# Altium project HYDRA_V2.1_NAV.PrjPcb
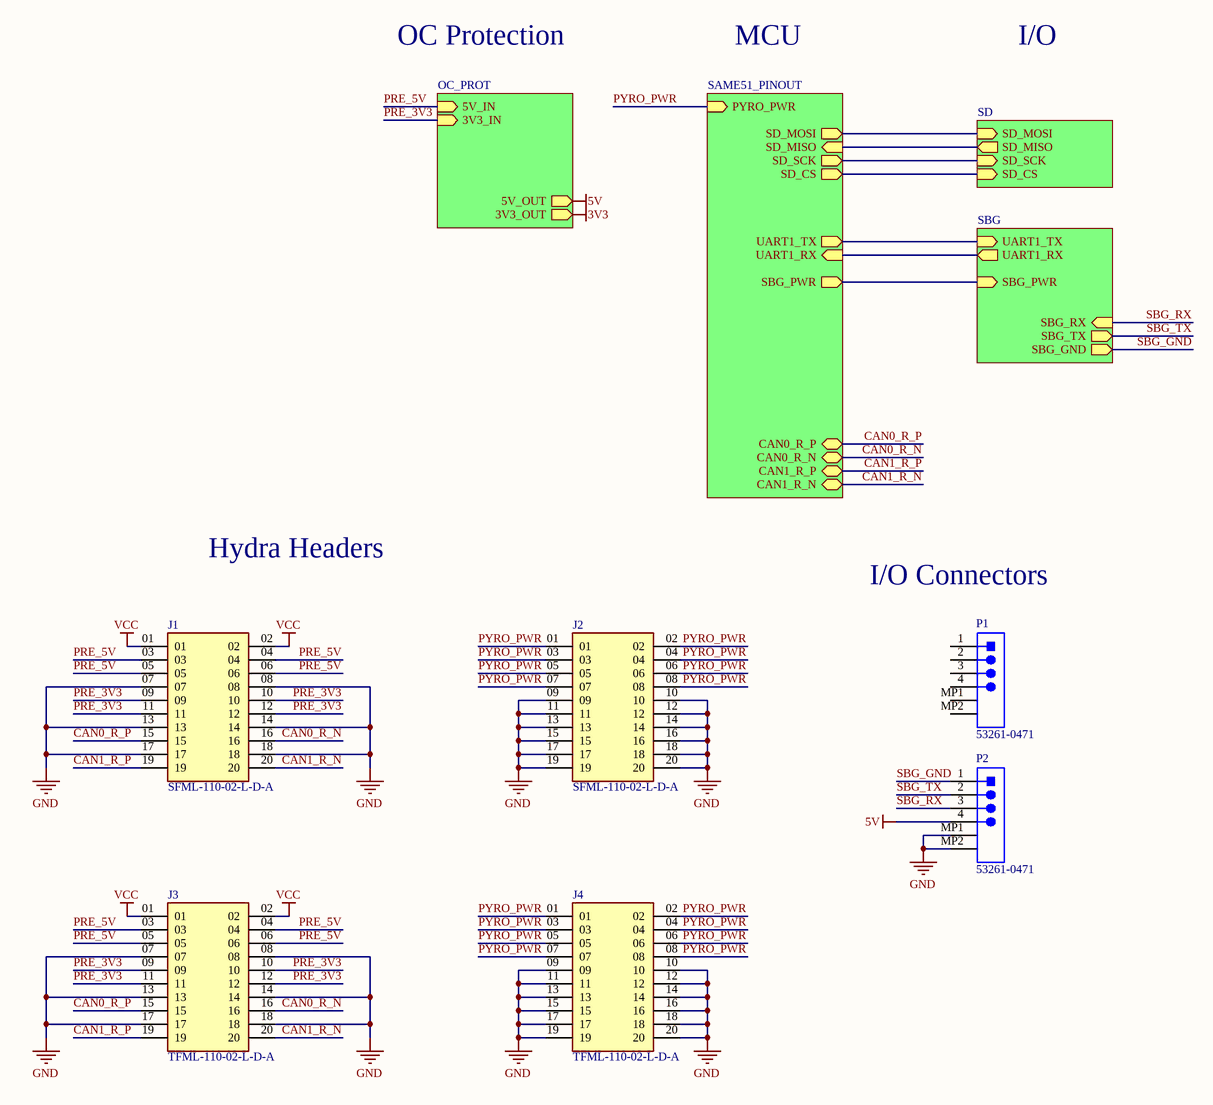
[diagram p0: HYDRA_V2.1_NAV.SchDoc]
4 sheets, 96 parts. Net scope: hierarchical (ports join the sheet entries above them; power ports are global).
Board files: HYDRA_V2.1_NAV.PcbDoc, HYDRA_V2.2_NAV.PcbDoc
Sheets:
  HYDRA_V2.1_NAV.SchDoc
    MCU_PINOUT = SAME51_PINOUT.SchDoc
    SBG = SBG.SchDoc
    SD = SD.SchDoc

## Sheet HYDRA_V2.1_NAV.SchDoc
size B; SheetNumber: 1; SheetTotal: 5

### Parts
J1  SFML-110-02-L-D-A  [SFML-110-02-L-D-A-Footprint-1]
J2  SFML-110-02-L-D-A  [SFML-110-02-L-D-A-Footprint-1]
J3  TFML-110-02-L-D-A  [TFML-110-02-L-D-A-Footprint-1]
J4  TFML-110-02-L-D-A  [TFML-110-02-L-D-A-Footprint-1]
P1  53261-0471  [MOLEX-53261-0471_V]
P2  53261-0471  [MOLEX-53261-0471_V]

### Sub-sheets
MCU_PINOUT = SAME51_PINOUT: CAN0_R_P (bidir), CAN0_R_N (bidir), PYRO_PWR (in), CAN1_R_P (bidir), CAN1_R_N (bidir), SD_MOSI (out), SD_MISO (in), SD_SCK (out), SD_CS (out), SBG_PWR (out), UART1_TX (out), UART1_RX (in)
OC_PROT = OC_PROT (file not in this document): 5V_OUT (out), 5V_IN (in), 3V3_IN (in), 3V3_OUT (out)
SBG = SBG: SBG_PWR (in), SBG_RX (in), SBG_TX (out), SBG_GND (out), UART1_TX (in), UART1_RX (out)
SD = SD: SD_MOSI (in), SD_MISO (out), SD_SCK (in), SD_CS (in)

### Nets
5V: P2.4 ; sheet OC_PROT/5V_OUT
GND: J1.07 J1.08 J1.13 J1.14 J1.17 J1.18 J2.09 J2.10 J2.11 J2.12 J2.13 J2.14 J2.15 J2.16 J2.17 J2.18 J2.19 J2.20 J3.07 J3.08 J3.13 J3.14 J3.17 J3.18 J4.09 J4.10 J4.11 J4.12 J4.13 J4.14 J4.15 J4.16 J4.17 J4.18 J4.19 J4.20 P2.MP1 P2.MP2
VCC: J1.01 J1.02 J3.01 J3.02
CAN0_R_N: J1.16 J3.16 ; sheet MCU_PINOUT/CAN0_R_N
CAN0_R_P: J1.15 J3.15 ; sheet MCU_PINOUT/CAN0_R_P
CAN1_R_N: J1.20 J3.20 ; sheet MCU_PINOUT/CAN1_R_N
CAN1_R_P: J1.19 J3.19 ; sheet MCU_PINOUT/CAN1_R_P
PRE_3V3: J1.09 J1.10 J1.11 J1.12 J3.09 J3.10 J3.11 J3.12 ; sheet OC_PROT/3V3_IN
PRE_5V: J1.03 J1.04 J1.05 J1.06 J3.03 J3.04 J3.05 J3.06 ; sheet OC_PROT/5V_IN
PYRO_PWR: J2.01 J2.02 J2.03 J2.04 J2.05 J2.06 J2.07 J2.08 J4.01 J4.02 J4.03 J4.04 J4.05 J4.06 J4.07 J4.08 ; sheet MCU_PINOUT/PYRO_PWR
SBG_GND: P2.1 ; sheet SBG/SBG_GND
SBG_PWR: sheet MCU_PINOUT/SBG_PWR, sheet SBG/SBG_PWR
SBG_RX: P2.3 ; sheet SBG/SBG_RX  [project net SBG_RS232_RX]
SBG_TX: P2.2 ; sheet SBG/SBG_TX  [project net SBG_RS232_TX]
SD_CLK: sheet MCU_PINOUT/SD_SCK, sheet SD/SD_SCK
SD_CMD: sheet MCU_PINOUT/SD_MOSI, sheet SD/SD_MOSI
SD_CS: sheet MCU_PINOUT/SD_CS, sheet SD/SD_CS
SD_DAT0: sheet MCU_PINOUT/SD_MISO, sheet SD/SD_MISO
UART1_RX: sheet MCU_PINOUT/UART1_RX, sheet SBG/UART1_RX
UART1_TX: sheet MCU_PINOUT/UART1_TX, sheet SBG/UART1_TX

Not connected (* = marked no-connect by the designer): P1 1 2 3 4 MP1 MP2

### Notes on the sheet
- OC Protection
- MCU
- I/O
- Hydra Headers
- I/O Connectors

### Library data of the parts
J1 J2 = CMP-002-00076-2: Headers & Wire Housings .050 Tiger Eye High-Reliability Locking Socket Strip
J3 J4 = CMP-002-00077-1: Conn Shrouded Header (4 Sides) HDR 20 POS 1.27mm Solder ST Top Entry SMD TIGER EYE™ Tube
P1 P2 = CMP-2000-05238-1: Male Header, Pitch 1.25 mm, 1 x 4 Position, Height 3.4 mm, -40 to 85 degC, RoHS, Tape and Reel; Current Rating: 1A; Brand: Molex; Number of Positions / Contacts: 4; Pitch: 1.25mm; Voltage Rating: 125V; Mounting Angle: Right; Manufacturer URL: http://www.molex.com/; Factory Pack Quantity: 1000; Housing Material: Thermoplastic; Datasheet URL: http://www.molex.com/pdm_docs/sd/532610471_sd.pdf; Tradename: PicoBlade; Product Type: Headers; Contact Plating: Tin; Contact Material: PhosphorBronze; Package Description: 1.25mm Pitch PicoBlade(TM) Header, Surface Mount, Right Angle, Lead-Free, 4 Circuits; Mounting Style: SMD/SMT; Manufacturer: Molex; Series: 53261; Packaging: Reel; Number of Rows: 1; RoHS: Details; Number of Positions: 4; Product Category: Headers&WireHousings; Datasheet Version: Rev. G, 01/2012; Type: Shrouded; Termination Style: SMD

## Sheet SAME51_PINOUT.SchDoc
size C; SheetNumber: 3; SheetTotal: 5
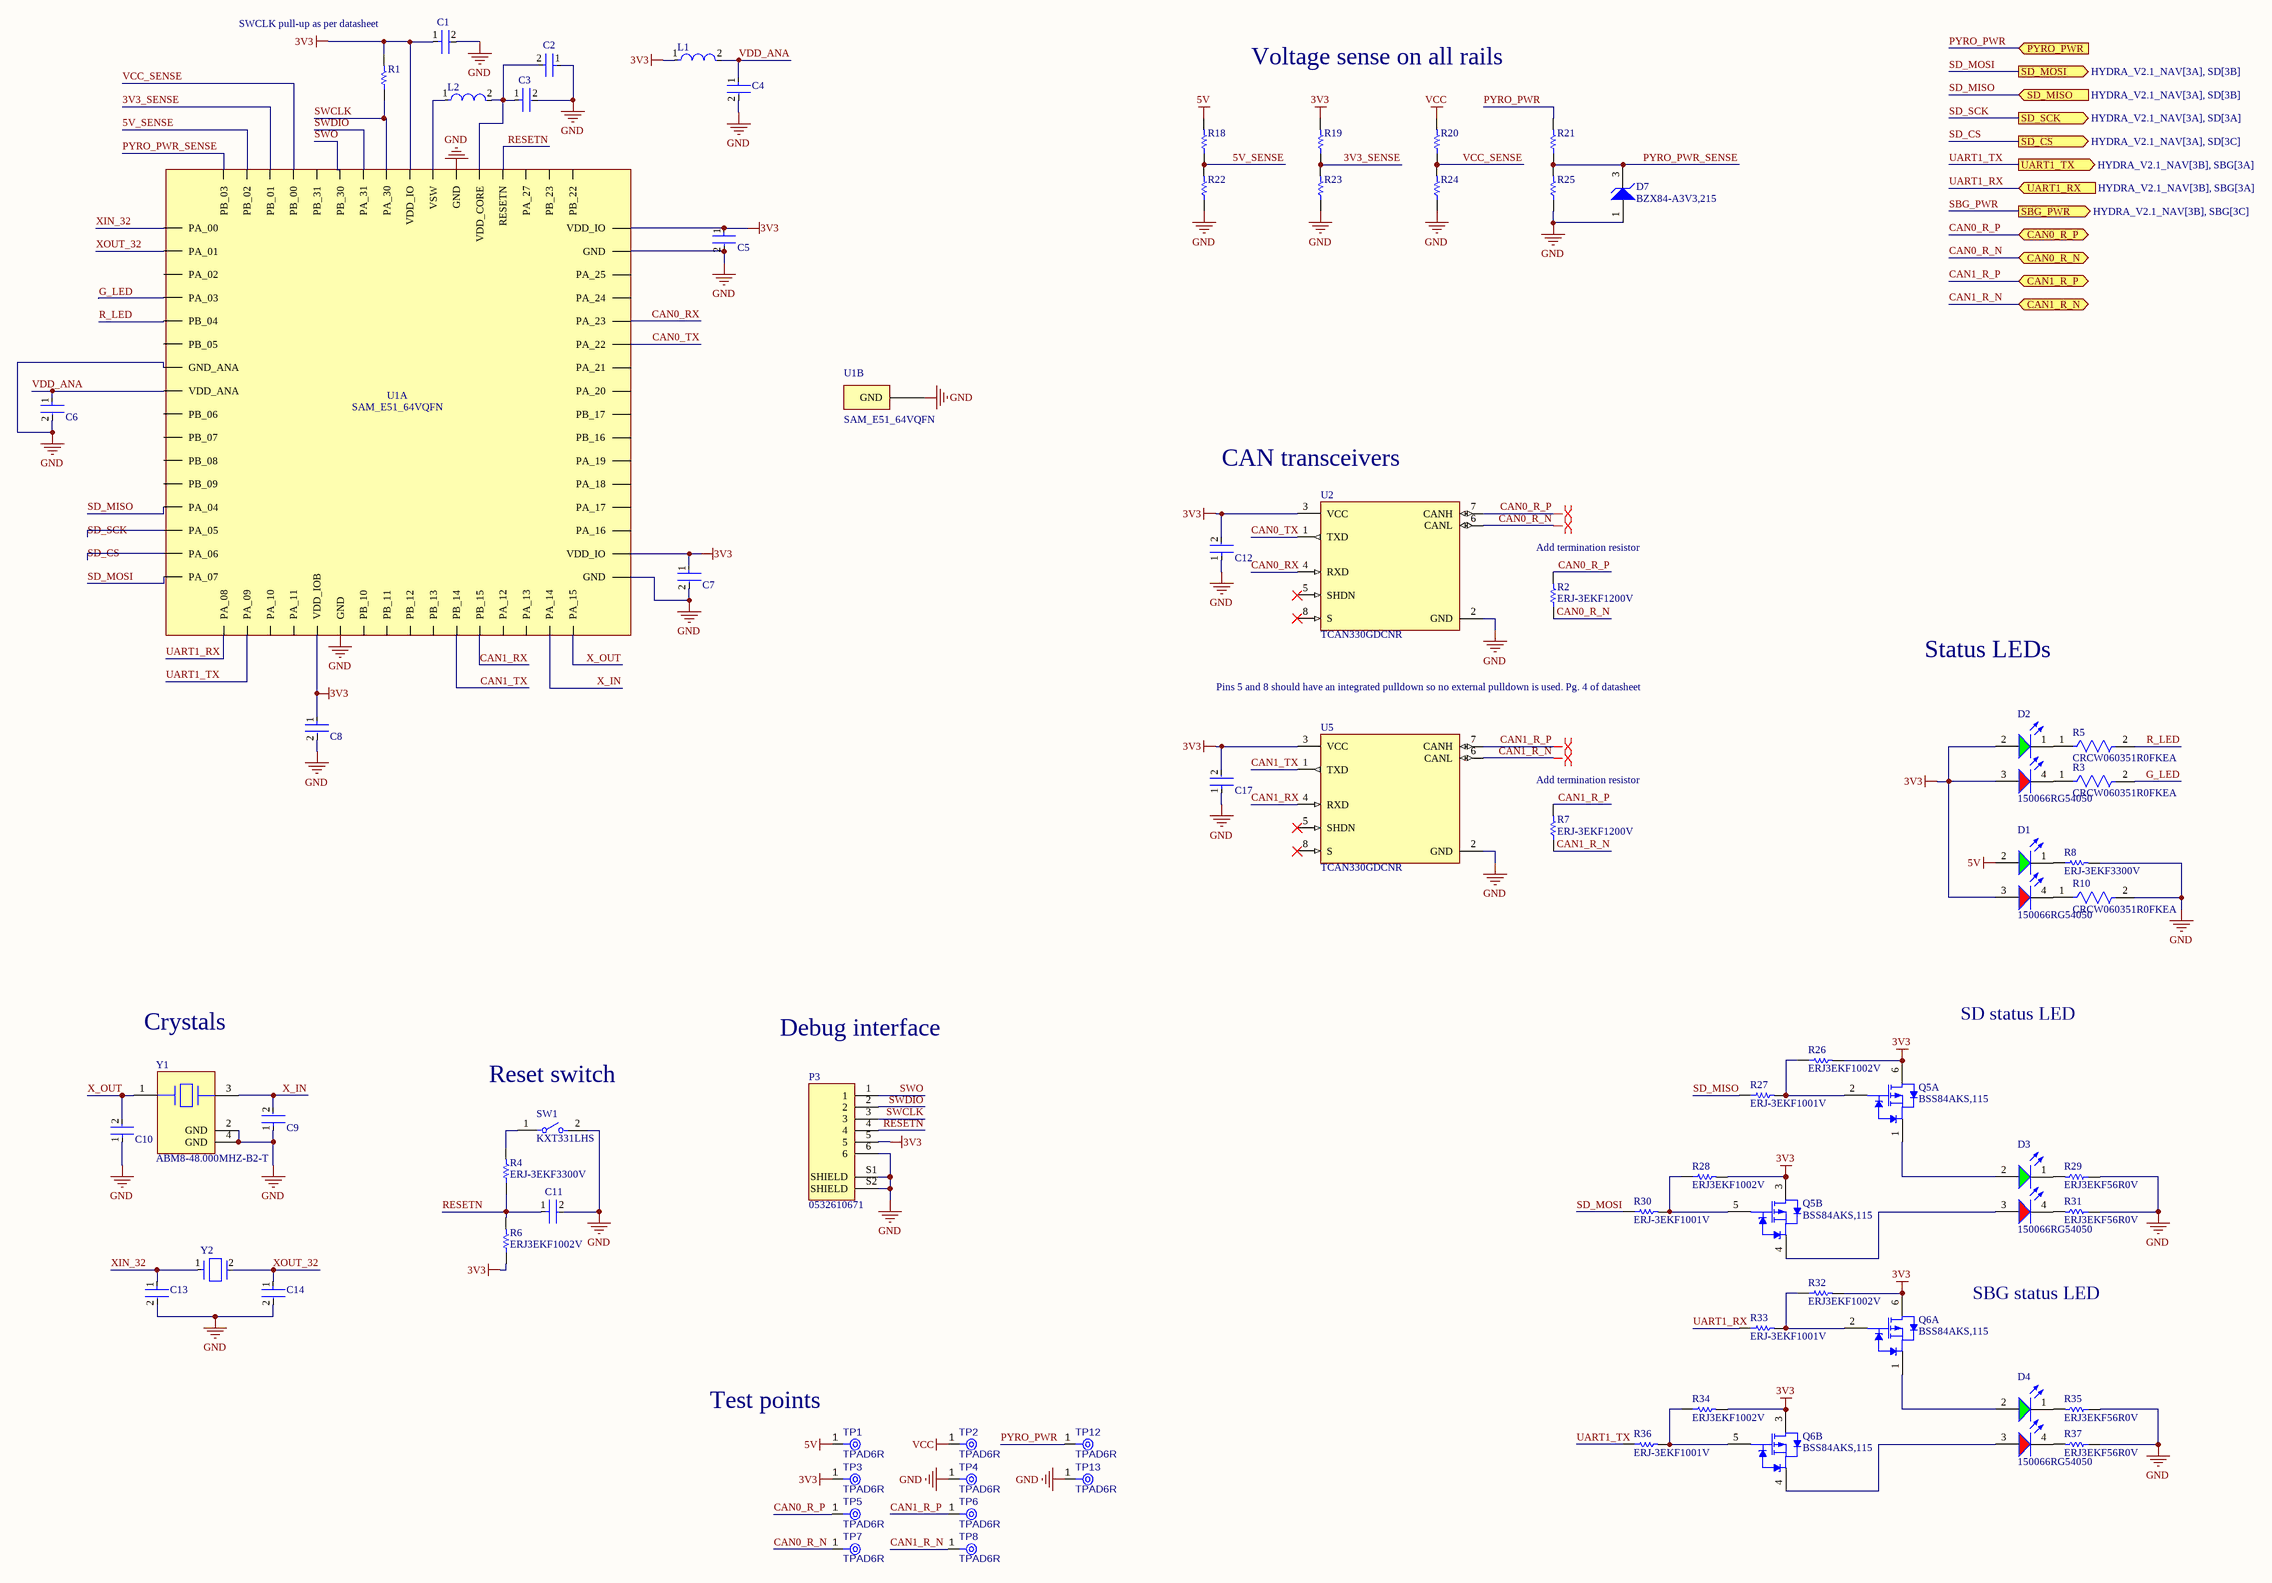
[diagram p1: SAME51_PINOUT.SchDoc]

### Parts
C1  C0402C104K8PACTU  [FP-C0402-BB-MFG]  (value not drawn)
C2  GRM155R60J475ME47D  [FP-GRM155-0_1-IPC_B]  (value not drawn)
C3  C0402C104K8PACTU  [FP-C0402-BB-MFG]  (value not drawn)
C4  C0805C106K8PACTU  [FP-C0805C-DG-MFG]  (value not drawn)
C5  C0402C104K8PACTU  [FP-C0402-BB-MFG]  (value not drawn)
C6  C0402C104K8PACTU  [FP-C0402-BB-MFG]  (value not drawn)
C7  C0402C104K8PACTU  [FP-C0402-BB-MFG]  (value not drawn)
C8  C0402C104K8PACTU  [FP-C0402-BB-MFG]  (value not drawn)
C9  08051A6R8CAT2A  [FP-0805-L_2_01_0_2-W_1_25-MFG]  (value not drawn)
C10  08051A6R8CAT2A  [FP-0805-L_2_01_0_2-W_1_25-MFG]  (value not drawn)
C11  C0402C104K8PACTU  [FP-C0402-BB-MFG]  (value not drawn)
C12  C0402C104K8PACTU  [FP-C0402-BB-MFG]  (value not drawn)
C13  C0805C180J5GACTU  [FP-C0805C-DN-MFG]  (value not drawn)
C14  C0805C180J5GACTU  [FP-C0805C-DN-MFG]  (value not drawn)
C17  C0402C104K8PACTU  [FP-C0402-BB-MFG]  (value not drawn)
D1  150066RG54050  [WL-SBCD_0606]
D2  150066RG54050  [WL-SBCD_0606]
D3  150066RG54050  [WL-SBCD_0606]
D4  150066RG54050  [WL-SBCD_0606]
D7  BZX84-A3V3,215  [SOT95P230X110-3N]
L1  NR6028T100M  [FP-NR6028-MFG]  (value not drawn)
L2  NR6028T100M  [FP-NR6028-MFG]  (value not drawn)
P3  0532610671  [0532610671-Footprint-1]
Q5  BSS84AKS,115  [NXP-SOT363_L]  (parts A,B of 2)
Q6  BSS84AKS,115  [NXP-SOT363_L]  (parts A,B of 2)
R1  ERJ3EKF1002V  [RESC1609X55X30LL15T15]  (value not drawn)
R2  ERJ-3EKF1200V  [RESC1609X55X30ML15T15]
R3  CRCW060351R0FKEA  [FP-CRCW0603-e3-MFG]
R4  ERJ-3EKF3300V  [RESC1608X55X30LL15T15]
R5  CRCW060351R0FKEA  [FP-CRCW0603-e3-MFG]
R6  ERJ3EKF1002V  [RESC1609X55X30LL15T15]
R7  ERJ-3EKF1200V  [RESC1609X55X30ML15T15]
R8  ERJ-3EKF3300V  [RESC1608X55X30LL15T15]
R10  CRCW060351R0FKEA  [FP-CRCW0603-e3-MFG]
R18  ERJ3EKF1002V  [RESC1609X55X30LL15T15]  (value not drawn)
R19  ERJ3EKF1002V  [RESC1609X55X30LL15T15]  (value not drawn)
R20  ERJ3EKF1002V  [RESC1609X55X30LL15T15]  (value not drawn)
R21  ERJ3EKF1002V  [RESC1609X55X30LL15T15]  (value not drawn)
R22  ERJ3EKF1002V  [RESC1609X55X30LL15T15]  (value not drawn)
R23  ERJ3EKF1002V  [RESC1609X55X30LL15T15]  (value not drawn)
R24  CRCW06032K70JNEA  [RESC1609X50X30ML10T20]  (value not drawn)
R25  CRCW06032K70JNEA  [RESC1609X50X30ML10T20]  (value not drawn)
R26  ERJ3EKF1002V  [RESC1609X55X30LL15T15]
R27  ERJ-3EKF1001V  [RESC1608X55X30LL15T15]
R28  ERJ3EKF1002V  [RESC1609X55X30LL15T15]
R29  ERJ3EKF56R0V  [RESC1608X55X30NL15T15]
R30  ERJ-3EKF1001V  [RESC1608X55X30LL15T15]
R31  ERJ3EKF56R0V  [RESC1608X55X30NL15T15]
R32  ERJ3EKF1002V  [RESC1609X55X30LL15T15]
R33  ERJ-3EKF1001V  [RESC1608X55X30LL15T15]
R34  ERJ3EKF1002V  [RESC1609X55X30LL15T15]
R35  ERJ3EKF56R0V  [RESC1608X55X30NL15T15]
R36  ERJ-3EKF1001V  [RESC1608X55X30LL15T15]
R37  ERJ3EKF56R0V  [RESC1608X55X30NL15T15]
SW1  KXT331LHS  [FP-KXT331LHS-MFG]
TP1  TPAD6R  [TP06R]  (no BOM)
TP2  TPAD6R  [TP06R]  (no BOM)
TP3  TPAD6R  [TP06R]  (no BOM)
TP4  TPAD6R  [TP06R]  (no BOM)
TP5  TPAD6R  [TP06R]  (no BOM)
TP6  TPAD6R  [TP06R]  (no BOM)
TP7  TPAD6R  [TP06R]  (no BOM)
TP8  TPAD6R  [TP06R]  (no BOM)
TP12  TPAD6R  [TP06R]  (no BOM)
TP13  TPAD6R  [TP06R]  (no BOM)
U1  SAM_E51_64VQFN  [SAM_E51_64VQFN-Footprint-1]  (parts A,B of 2)
U2  TCAN330GDCNR  [FP-DCN0008A-MFG]
U5  TCAN330GDCNR  [FP-DCN0008A-MFG]
Y1  ABM8-48.000MHZ-B2-T  [FP-ABM8-MFG]
Y2  ECS-.327-12.5-1210-TR  [FP-ECX-1210-MFG]  (value not drawn)

### Ports
CAN0_R_N (bidir, see HYDRA_V2.1_NAV[3B]), CAN0_R_P (bidir, see HYDRA_V2.1_NAV[3B]), CAN1_R_N (bidir, see HYDRA_V2.1_NAV[3B]), CAN1_R_P (bidir, see HYDRA_V2.1_NAV[3B]), PYRO_PWR (in, see HYDRA_V2.1_NAV[3A]), SBG_PWR (out, see HYDRA_V2.1_NAV[3B], SBG[3C]), SD_CS (out, see HYDRA_V2.1_NAV[3A], SD[3C]), SD_MISO (in, see HYDRA_V2.1_NAV[3A], SD[3B]), SD_MOSI (out, see HYDRA_V2.1_NAV[3A], SD[3B]), SD_SCK (out, see HYDRA_V2.1_NAV[3A], SD[3A]), UART1_RX (in, see HYDRA_V2.1_NAV[3B], SBG[3A]), UART1_TX (out, see HYDRA_V2.1_NAV[3B], SBG[3A])

### Nets
3V3: C1.1 C5.1 C7.1 C8.1 C12.2 C17.2 D1.3(A) D2.2(A) D2.3(A) L1.1 P3.5 Q5.3(D2) Q5.6(D1) Q6.3(D2) Q6.6(D1) R1.2 R6.1 R19.2 R26.2 R28.2 R32.2 R34.2 TP3.1(TP) U1.21(VDD_IOB) U1.34(VDD_IO) U1.48(VDD_IO) U1.56(VDD_IO) U2.3(VCC) U5.3(VCC)
5V: D1.2(A) R18.2 TP1.1(TP)
GND: C1.2 C2.1 C3.2 C4.2 C5.2 C6.2 C7.2 C8.2 C9.1 C10.1 C11.2 C12.1 C13.2 C14.2 C17.1 D7.1(A) P3.6 P3.S1(SHIELD) P3.S2(SHIELD) R8.2 R10.2 R22.1 R23.1 R24.1 R25.1 R29.1 R31.1 R35.1 R37.1 SW1.2 TP4.1(TP) TP13.1(TP) U1.7(GND_ANA) U1.22(GND) U1.33(GND) U1.47(GND) U1.54(GND) U1.65(GND) U2.2(GND) U5.2(GND) Y1.2(GND) Y1.4(GND)
VCC: R20.2 TP2.1(TP)
3V3_SENSE: R19.1 R23.2 U1.62(PB_01)
5V_SENSE: R18.1 R22.2 U1.63(PB_02)
CAN0_R_N: R2.1 TP7.1(TP) U2.6(CANL) ; port CAN0_R_N
CAN0_R_P: R2.2 TP5.1(TP) U2.7(CANH) ; port CAN0_R_P
CAN0_RX: U1.44(PA_23) U2.4(RXD)
CAN0_TX: U1.43(PA_22) U2.1(TXD)
CAN1_R_N: R7.1 TP8.1(TP) U5.6(CANL) ; port CAN1_R_N
CAN1_R_P: R7.2 TP6.1(TP) U5.7(CANH) ; port CAN1_R_P
CAN1_RX: U1.28(PB_15) U5.4(RXD)
CAN1_TX: U1.27(PB_14) U5.1(TXD)
G_LED: R3.2 U1.4(PA_03)
PYRO_PWR: R21.2 TP12.1(TP) ; port PYRO_PWR
PYRO_PWR_SENSE: D7.3(K) R21.1 R25.2 U1.64(PB_03)
R_LED: R5.2 U1.5(PB_04)
RESETN: C11.1 P3.4 R4.1 R6.2 U1.52(RESETN)
SD_CS: U1.15(PA_06) ; port SD_CS
SD_MISO: R27.1 U1.13(PA_04) ; port SD_MISO  [project net SD_DAT0]
SD_MOSI: R30.1 U1.16(PA_07) ; port SD_MOSI  [project net SD_CMD]
SD_SCK: U1.14(PA_05) ; port SD_SCK  [project net SD_CLK]
SWCLK: P3.3 R1.1 U1.57(PA_30)
SWDIO: P3.2 U1.58(PA_31)
SWO: P3.1 U1.59(PB_30)
UART1_RX: R33.1 U1.17(PA_08) ; port UART1_RX
UART1_TX: R36.1 U1.18(PA_09) ; port UART1_TX
VCC_SENSE: R20.1 R24.2 U1.61(PB_00)
VDD_ANA: C4.1 C6.1 L1.2 U1.8(VDD_ANA)
X_IN: C9.2 U1.31(PA_14) Y1.3
X_OUT: C10.2 U1.32(PA_15) Y1.1
XIN_32: C13.1 U1.1(PA_00) Y2.1(In/Out)
XOUT_32: C14.1 U1.2(PA_01) Y2.2(Out/In)
NetC2_2: C2.2 C3.1 L2.2 U1.53(VDD_CORE)
NetD1_1: D1.1(K) R8.1
NetD1_4: D1.4(K) R10.1
NetD2_1: D2.1(K) R5.1
NetD2_4: D2.4(K) R3.1
NetD3_1: D3.1(K) R29.2
NetD3_2: D3.2(A) Q5.1(S1)
NetD3_3: D3.3(A) Q5.4(S2)
NetD3_4: D3.4(K) R31.2
NetD4_1: D4.1(K) R35.2
NetD4_2: D4.2(A) Q6.1(S1)
NetD4_3: D4.3(A) Q6.4(S2)
NetD4_4: D4.4(K) R37.2
NetL2_1: L2.1 U1.55(VSW)
NetQ5_2: Q5.2(G1) R26.1 R27.2
NetQ5_5: Q5.5(G2) R28.1 R30.2
NetQ6_2: Q6.2(G1) R32.1 R33.2
NetQ6_5: Q6.5(G2) R34.1 R36.2
NetR4_2: R4.2 SW1.1

Not connected (* = marked no-connect by the designer): U1 3(PA_02) 6(PB_05) 9(PB_06) 10(PB_07) 11(PB_08) 12(PB_09) 19(PA_10) 20(PA_11) 23(PB_10) 24(PB_11) 25(PB_12) 26(PB_13) 29(PA_12) 30(PA_13) 35(PA_16) 36(PA_17) 37(PA_18) 38(PA_19) 39(PB_16) 40(PB_17) 41(PA_20) 42(PA_21) 45(PA_24) 46(PA_25) 49(PB_22) 50(PB_23) 51(PA_27) 60(PB_31); U2 5(SHDN)* 8(S)*; U5 5(SHDN)* 8(S)*

### Layout directives
differential pair: CAN0_R_N, CAN0_R_P, CAN1_R_N, CAN1_R_P

### Notes on the sheet
- SWCLK pull-up as per datasheet
- Voltage sense on all rails
- (near U2) CAN transceivers
- (near R2) Add termination resistor
- Pins 5 and 8 should have an integrated pulldown so no external pulldown is used. Pg. 4 of datasheet
- Status LEDs
- (near R7) Add termination resistor
- Crystals
- Debug interface
- SD status LED
- (near SW1) Reset switch
- SBG status LED
- (near TP1) Test points

### Library data of the parts
C1 C3 C5-C8 C11 C12 C17 = CMP-2008-02046-2: CAP CER 0.1UF 10V X5R 0402; Manufacturer: Kemet; Material: Ceramic; Capacitance: 0.10 μF; Temperature Coefficient: 15%; Tolerance: 0.1; Value: 0.10 μF; Package: C0402-BB; Temperature: -55°C to +125°C; ComponentLink2Description: Datasheet; Temperature Characteristic: X5R; Device Class L1: Passive Components; Height: 0.55mm; Lead Free: Yes; ComponentLink2URL: https://content.kemet.com/datasheets/KEM_C1002_X7R_SMD.pdf; Device Class L2: Capacitors; Temperature Range Low: -55°C; Temperature Range High: +125°C; RoHS: TRUE; Octopart: https://octopart.com/c0402c104k8pactu-kemet-140039; Automotive: No; Mouser Description: Capacitor 100 nF 10 VDC 0402; Category: Cap; Voltage Rating: 10 V; Digikey Description: CAP CER 0.1UF 10V X5R 0402; Ipc Land Pattern Name: CAPC10050X50; Device Class L3: Ceramic Capacitors; Manufacturer Part Number: C0402C104K8PACTU
C2 = CMP-2008-04549-2: Chip Multilayer Ceramic Capacitors for General Purpose, 0402, 4.7uF, X5R, 15%, 20%, 6.3V; Height: 0.5mm; Weight: 0.000212oz; Length: 1mm; Case Code (Metric): 1005; Packaging: Tape and Reel; Termination: SMD/SMT; Dielectric: X5R; Depth: 0.5mm; Case Code (Imperial): 0402; Min Operating Temperature: -55°C; Case/Package: 0402; Voltage: 6.3V; Width: 0.02inch; Capacitance: 4.7uF; Lead Free: Lead Free; Thickness: 0.022inch; Contact Plating: Tin; REACH SVHC: No SVHC; Package Quantity: 10000; Tolerance: 20%; Voltage Rating (DC): 6.3V; Voltage Rating: 6.3V; Mount: Surface Mount; Max Operating Temperature: 85°C
C4 = CMP-2007-03243-2: CAP CER 10UF 10V X5R 0805; Manufacturer: Kemet; 3DS Part Number: 220-00001; Tolerance: 10%; Temperature Coefficient: 15%; Material: Ceramic; Device Class L2: Capacitors; Device Class L1: Passive Components; ComponentLink2URL: https://content.kemet.com/datasheets/KEM_C1006_X5R_SMD.pdf; Height: 1.4mm; Lead Free: Yes; Manufacturer Part Number: C0805C106K8PACTU; Digikey Description: CAP CER 10UF 10V X5R 0805; Octopart: https://octopart.com/c0805c106k8pactu-kemet-98697; Capacitance: 10uF; Value: 10uF; Temperature Range Low: -55°C; Temperature: -55°C to +85°C; Automotive: No; Mouser Description: CAP CER 10UF 10V X5R 0805; Ipc Land Pattern Name: CAPC200125X125; Temperature Range High: +85°C; Voltage: 10V; RoHS: TRUE; Device Class L3: Ceramic Capacitors; ComponentLink2Description: Datasheet; Voltage Rating: 10V; Package: C0805C-DG; Temperature Characteristic: X5R; Category: Cap
C9 C10 = CMP-1036-00709-3: General Purpose Ceramic Capacitor, 0805, 6.8pF, 0.25pF, C0G, 30ppm/°C, 100V; Dissipation Factor: 10%; Insulation Resistance: 100GR; Tolerance: 5%; Max Operating Temperature: 125°C; RoHS Compliant: Yes; Capacitance: 6.8pF; Termination: SMD/SMT; Number of Pins: 2; Packaging: Tape and Reel; Mount: Surface Mount; Case Code (Metric): 2012; Case Code (Imperial): 0805; Height: 0.71mm; Min Operating Temperature: -55°C; Width: 0.049inch; Temperature Coefficient: 0ppm/°C; Length: 2.01mm; Dielectric: C0G; Series: -; Voltage Rating (DC): 100V; Dielectric Material: Ceramic; Depth: 1.25mm; Contact Plating: Tin; Voltage Rating: 100V; Thickness: 0.037inch; Case/Package: 0805; Lead Free: Lead Free; Radiation Hardening: No; Voltage: 100V; Construction: Flat; Package Quantity: 1; REACH SVHC: No SVHC
C13 C14 = CMP-2007-00302-2: CAP CER 18PF 50V C0G/NP0 0805; Manufacturer: KEMET; Temperature Characteristic: C0G; Tolerance: 0.05; Material: Ceramic; Temperature Coefficient: 30ppm/°C; Device Class L2: Capacitors; Capacitance: 18 pF; Temperature: -55°C to +125°C; Value: 18 pF; Package: C0805C-DN; Mouser Description: Cap Ceramic 18pF 50V C0G 5% SMD 0805 125C Paper T/R; Height: 0.88mm; ComponentLink2URL: https://content.kemet.com/datasheets/KEM_C1003_C0G_SMD.pdf; RoHS: TRUE; Octopart: https://octopart.com/c0805c180j5gactu-kemet-144810; ComponentLink2Description: Datasheet; Temperature Range High: +125°C; Digikey Description: CAP CER 18PF 50V C0G/NP0 0805; Device Class L1: Passive Components; Category: Cap; Automotive: No; Device Class L3: Ceramic Capacitors; Voltage Rating: 50 V; Temperature Range Low: -55°C; Ipc Land Pattern Name: CAPC200125X78; Lead Free: Yes; Manufacturer Part Number: C0805C180J5GACTU
D1-D4 = CMP-004-00034-2: Led, Red/Grn, 180Mcd/230Mcd, 624Nm/525Nm Rohs Compliant: Yes
D7 = CMP-004-00035-1: DIODE ZENER 3.3V 250MW SOT23
L1 L2 = CMP-14484-000406-1: SMD Power Inductors 10uH ±20% 1.9A 84.5mΩ; Core Material: Ferrite; Self Resonant Frequency: 20MHz; Test Frequency: 100kHz; DC Resistance (DCR): 84.5mR; Shielding: Shielded; Current Rating: 1.9A; Package Quantity: 2000; Tolerance: 20%; Saturation Current: 1.9A; Max Operating Temperature: 120°C; Case/Package: 2424; Number of Pins: 2; Lead Free: Lead Free; Series: NR; Inductance Tolerance: 20%; RMS Current (Irms): 1.9A; Max DC Current: 1.9A; Resistor Type: Wirewound; Min Operating Temperature: -25°C; Width: 6mm; Height - Seated (Max): 0.11inch; RoHS Compliant: Yes; Mount: Surface Mount; Packaging: Tape and Reel; Inductance: 10uH; Length: 0.236inch; Halogen Free: Halogen Free; Height: 2.8mm; Termination: SMD/SMT
P3 = CMP-002-00079-1: Conn Shrouded Header (4 Sides) HDR 6 POS 1.25mm Solder RA Side Entry SMD PicoBlade™ T/R
Q5 Q6 = CMP-1259-00116-1: Dual P-Channel Trench MOSFET, -50 V, -0.16 A, -55 to 150 degC, 6-Pin SOT363, Tape and Reel; Manufacturer: NXP Semiconductors; VGSth [typ] (V): -1.6; Automotive Qualified: Y; Channel Type: P; IDM [max] (A): -0.64; Packing: Tape & Reel; Mounting Technology: Surface Mount; PackageDescription: 6-Pin Small Outline Transistor Package, Body 2 x 1.25 mm, Pitch 0.65 mm; ComponentLink2URL: http://www.nxp.com/documents/data_sheet/BSS84AKS.pdf; ComponentLink3URL: http://www.nxp.com/documents/outline_drawing/sot363_po.pdf; PartNumber: BSS84AKS,115; PackageReference: SOT363; PackageVersion: 06-03-16, 03/2006; ComponentLink3Description: Package Specification; ComponentLink2Description: Datasheet; ComponentLink1Description: Manufacturer URL; VDS [max] (V): -50; Code_JEITA: SC-88; ID [max] (A): -0.16; DatasheetVersion: Rev. 1; ComponentLink1URL: http://www.nxp.com/
R1 R6 R18-R23 R26 R28 R32 R34 = CMP-1012-00623-3: Chip Resistor, 10 KOhm, +/- 1%, 0.1 W, -55 to 155 degC, 0603 (1608 Metric), RoHS, Tape and Reel; Manufacturer: Panasonic; Voltage Rating: 75V; Case\/Package: 0603; Power Rating: 100mW; Resistance: 10KOhm; Temperature Coefficient: 100ppm\/degreesC; Number of Pins: 2; Package Reference: 603; Depth: 0.8mm; Mount: SurfaceMount; Package Description: 2-Pin Surface Mount Device, Body 1.6 x 0.85 mm; Datasheet Version: 02/2017; Length: 1.6mm; Lead Free: LeadFree; Height: 0.45mm; Number of Terminations: 2; Max Power Dissipation: 100mW; Min Operating Temperature: -55degC; Datasheet URL: https://industrial.panasonic.com/cdbs/www-data/pdf/RDA0000/AOA0000C304.pdf; Termination: SMD/SMT; Case Code (Metric): 1608; Case Code (Imperial): 0603; Tolerance: 1%; Max Operating Temperature: 155degC; RoHSCompliant: true; Voltage Rating (DC): 75V; Radiation Hardening: No; Packaging: TapeandReel; Composition: ThickFilm; Mounting Technology: SurfaceMount; Manufacturer URL: http://www.panasonic.com/; Width: 0.031inch; REACH SVHC: NoSVHC; Contact Plating: Tin; Military Standard: Not; Package Quantity: 1
R2 R7 = CMP-2000-00213-2: Chip Resistor, 120 Ohm, +/- 1%, 0.1 W, -55 to 155 degC, 0603 (1608 Metric), RoHS, Tape and Reel; Manufacturer: Panasonic; Power Rating: 100mW; Voltage Rating (DC): 75V; Resistance: 120Ohm; Temperature Coefficient: 100ppm/degreesC; Number of Terminations: 2; Military Standard: Not; Tolerance: 1%; Min Operating Temperature: -55degC; Packaging: TapeandReel; Lead Free: LeadFree; Max Operating Temperature: 155degC; Manufacturer URL: http://www.panasonic.com/; Case Code (Imperial): 0603; REACH SVHC: NoSVHC; Width: 0.031inch; Datasheet URL: https://industrial.panasonic.com/cdbs/www-data/pdf/RDA0000/AOA0000C283.pdf; RoHSCompliant: true; Max Power Dissipation: 100mW; Termination: SMD/SMT; Package Reference: 0603; Height: 0.022inch; Depth: 0.8mm; Package Description: 2-Pin Surface Mount Device, Body 1.6 x 0.85 mm; Contact Plating: Tin; Length: 1.6mm; Package URL: http://www.st.com/st-web-ui/static/active/en/resource/technical/document/datasheet/CD00001320.pdf; Radiation Hardening: No; Package Quantity: 1; Number of Pins: 2; Datasheet Version: 42095.0; Voltage Rating: 75V; Composition: ThickFilm; Case/Package: 0603; Mount: SurfaceMount; Case Code (Metric): 1608
R3 R5 R10 = CMP-2000-03446-2: RES Thick Film, 51Ω, 1%, 0.1W, 100ppm/°C, 0603; Power Rating: 100mW; Voltage Rating: 75V; Resistance: 51R; Military Standard: Not; Case Code (Imperial): 0603; Max Operating Temperature: 155°C; Temperature Coefficient: 100ppm/°C; Lead Free: Lead Free; Weight: 7.1E-05oz; Number of Pins: 2; Package Quantity: 10; Case/Package: 0603; Termination: SMD/SMT; Min Operating Temperature: -55°C; Tolerance: 1%; Contact Plating: Tin; Height: 0.45mm; Working Voltage: 75V; Radiation Hardening: No; Packaging: Tape and Reel; Composition: Thick Film; Max Power Dissipation: 100mW; Width: 0.85mm; Depth: 0.85mm; Length: 1.55mm; Case Code (Metric): 1608; Voltage Rating (DC): 75V; Number of Terminations: 2; Features: Automotive AEC-Q200
R4 R8 = CMP-2000-00435-2: Chip Resistor, 330 Ohm, +/- 1%, 0.1 W, -55 to 155 degC, 0603 (1608 Metric), RoHS, Tape and Reel; Gender: Male; Mating Cycles: 10000; Current Rating: 500 mA; Voltage Rating: 10 V; REACH SVHC: No SVHC; PackageDescription: 2-Pin Surface Mount Device, Body 1.6 x 0.85 mm; Contact Finish: Gold; Pins: 8; ComponentLink1Description: Manufacturer URL; Packaging: Tape and Reel; Max Operating Temperature: 85 degC; Contact Material: Copper; Height: 1.45 mm; Width: 1.45 mm; DatasheetVersion: Apr-15; Package Quantity: 1500; Contact Plating: Gold; PackageReference: 0603; Mount: Surface Mount; Lead Pitch: 1.1 mm; Min Operating Temperature: -25 degC; ComponentLink1URL: http://www.panasonic.com/; ComponentLink2URL: http://industrial.panasonic.com/cdbs/www-data/pdf/RDA0000/AOA0000C86.pdf; Length: 13.7 mm; ComponentLink2Description: Datasheet; RoHSCompliant: true
R24 R25 = CMP-2000-03183-1: Manufacturer: Vishay Dale; Part Number: CRCW06032K70JNEA
R27 R30 R33 R36 = CMP-2000-00180-1: Manufacturer: Panasonic; Part Number: ERJ-3EKF1001V
R29 R31 R35 R37 = CMP-2000-00572-1: Manufacturer: Panasonic; Part Number: ERJ3EKF56R0V
SW1 = CMP-10040-000029-1: SWITCH TACTILE SPST-NO 0.02A 15V; Operating Force: 240gf; Switch Travel: 0.13mm; Illumination Type: Non-Illuminated; Throw Configuration: SPST; Number of Ports: 1; Current Rating: 5A; Mechanical Life: 500000Cycles; Switch Function: Off-Mom; Connector Type: USB; Actuator Type: Standard; Gender: Receptacle; Number of Contacts: 24; Contact Plating: Gold; Insulation Color: Black; Min Operating Temperature: -40°C; Packaging: Tape and Reel; Flammability Rating: UL94 V-0; Max Operating Temperature: 85°C; Termination: Solder; Mount: Surface Mount
TP1-TP8 TP12 TP13 = CMP-00028-00002-2: 0.6mm round; Pins: 1
U1 = CMP-016-00010-6: Rudimentary symbol and footprint for the SAM E51 microcontroller
U2 U5 = CMP-04872-000178-1: IC TRANSCEIVER 1/1 SOT23-8; Data Rate: 1Mbps; Packaging: Tape and Reel; Min Operating Temperature: -40°C; Max Operating Temperature: 125°C; RoHS Compliant: Yes; Lead Free: Lead Free; Case/Package: SOT-23-8; Mount: Surface Mount
Y1 = CMP-27762-011708-1: Crystal 48MHz ±20ppm 18pF SMD-4 3.2mm x 2.5mm; Series Resistance: 35R; Frequency Stability: 50ppm; Package Quantity: 1000; Packaging: Tape and Reel; Mount: Surface Mount; Length: 3.2mm; Load Capacitance: 18pF; Max Operating Temperature: 70°C; Operating Frequency: 48 MHz; RoHS Compliant: Yes; Series: ABM8; Frequency Tolerance: 20ppm; Lead Free: Lead Free; Min Operating Temperature: -20°C; Case/Package: CSMD; Number of Pins: 4; Height: 0.031inch; ESR (Equivalent Series Resistance): 35R; Frequency: 48MHz; Radiation Hardening: No; Width: 0.098inch; Tolerance: 20ppm; Termination: SMD/SMT; Depth: 2.5mm; Resistor Type: Ceramic; REACH SVHC: No SVHC
Y2 = CMP-40224-000006-1: CRYSTAL 32.7680KHZ 12.5PF SMD; Manufacturer: ECS International; Frequency: 32.768kHz; Esr: 90kΩ; Tolerance: 20ppm; Device Class L1: Passive Components; Load Capacitance: 12.5pF; Temperature: -40°C to +85°C; ComponentLink2URL: https://ecsxtal.com/store/pdf/ECX-1210.pdf; Series: ECX-1210; Octopart: https://octopart.com/ecs-.327-12.5-1210-tr-ecs+international-81221340; ComponentLink2Description: Datasheet; Temperature Range Low: -40°C; Digikey Description: CRYSTAL 32.7680KHZ 12.5PF SMD; Lead Free: Yes; RoHS: TRUE; Device Class L3: Crystals; Automotive: No; Category: Crys; Height: 0.5mm; Manufacturer Part Number: ECS-.327-12.5-1210-TR; Temperature Range High: +85°C; Device Class L2: Crystals / Oscillators; Package: ECX-1210

## Sheet SBG.SchDoc
size A4; SheetNumber: 4; SheetTotal: 5
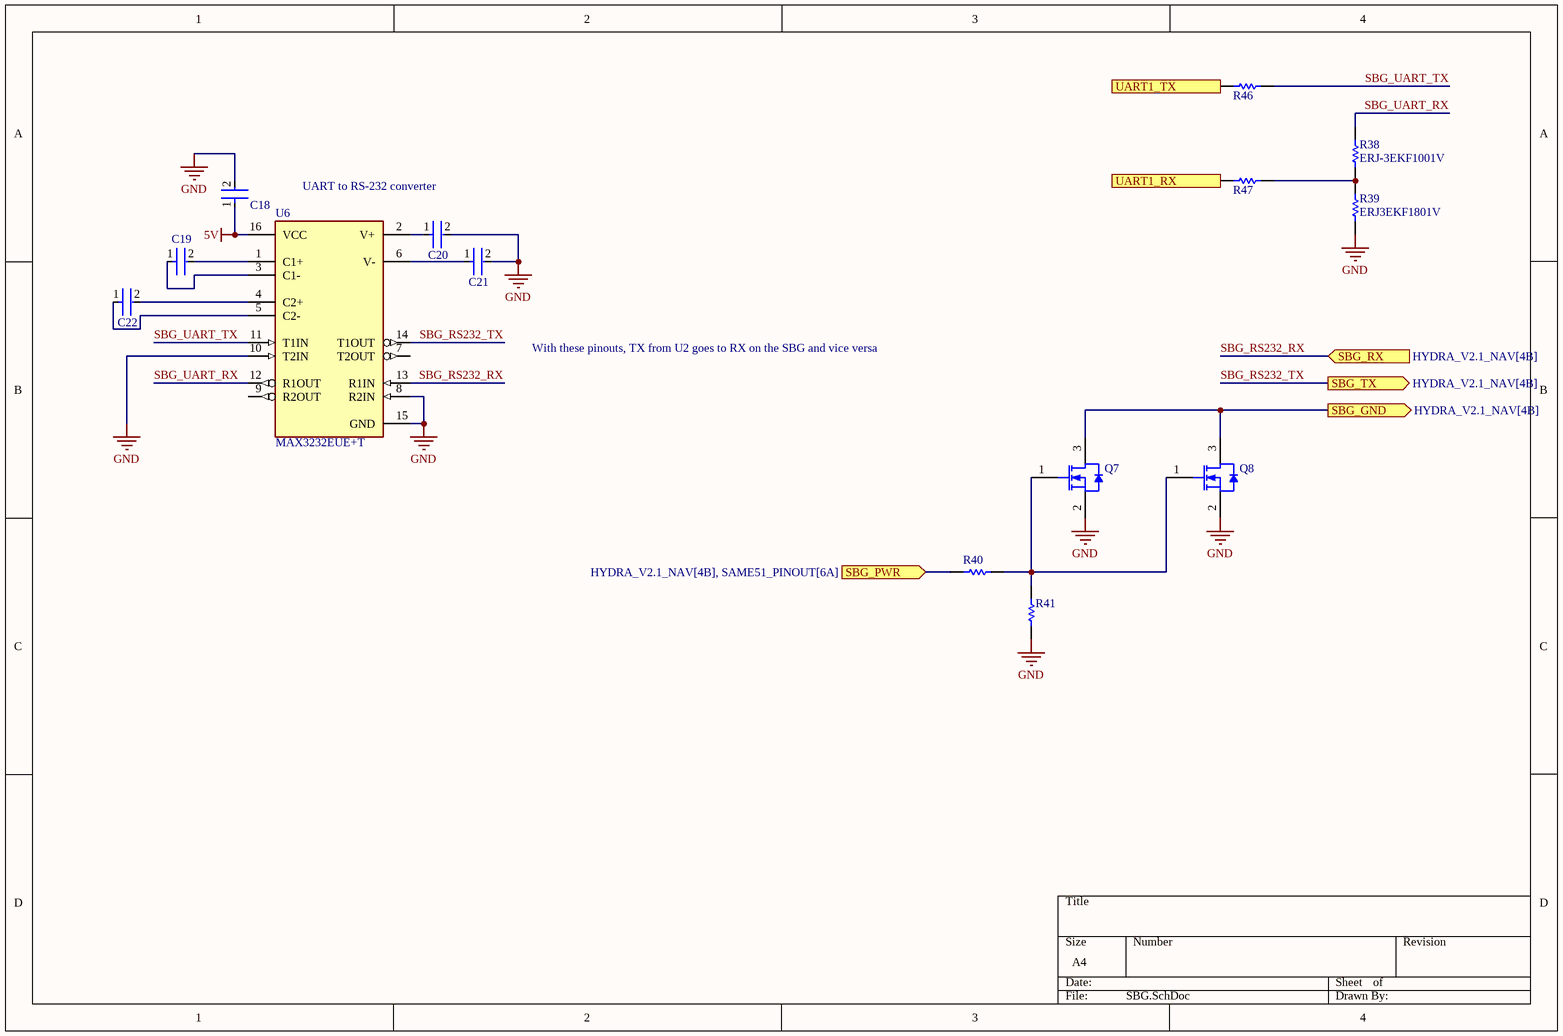
[diagram p2: SBG.SchDoc]

### Parts
C18  C0402C104K8PACTU  [FP-C0402-BB-MFG]  (value not drawn)
C19  C1005X5R1A475K050BC  [FP-C1005-050-0_15-MFG]  (value not drawn)
C20  C1005X5R1V334K050BC  [FP-C1005-050-0_05-IPC_B]  (value not drawn)
C21  C1005X5R1V334K050BC  [FP-C1005-050-0_05-IPC_B]  (value not drawn)
C22  C1005X5R1V334K050BC  [FP-C1005-050-0_05-IPC_B]  (value not drawn)
Q7  BSS138W-7-F  [DIOD-SOT323-3_V]  (value not drawn)
Q8  BSS138W-7-F  [DIOD-SOT323-3_V]  (value not drawn)
R38  ERJ-3EKF1001V  [RESC1608X55X30LL15T15]
R39  ERJ3EKF1801V  [RESC1608X55X30LL15T15]
R40  ERJ-3EKF1001V  [RESC1608X55X30LL15T15]  (value not drawn)
R41  ERJ3EKF1002V  [RESC1609X55X30LL15T15]  (value not drawn)
R46  0402 JUMPER 0 OHM  [RESC1005X40X25NL05T05]  (value not drawn)
R47  0402 JUMPER 0 OHM  [RESC1005X40X25NL05T05]  (value not drawn)
U6  MAX3232EUE+T  [FP-U16-1-MFG]

### Ports
SBG_GND (out, see HYDRA_V2.1_NAV[4B]), SBG_PWR (in, see HYDRA_V2.1_NAV[4B], SAME51_PINOUT[6A]), SBG_RX (in, see HYDRA_V2.1_NAV[4B]), SBG_TX (out, see HYDRA_V2.1_NAV[4B]), UART1_RX (out), UART1_TX (in)

### Nets
5V: C18.1 U6.16(VCC)
GND: C18.2 C20.2 C21.2 Q7.2(S) Q8.2(S) R39.1 R41.1 U6.8(R2IN) U6.10(T2IN) U6.15(GND)
SBG_GND: Q7.3(D) Q8.3(D) ; port SBG_GND
SBG_PWR: R40.1 ; port SBG_PWR
SBG_RS232_RX: U6.13(R1IN) ; port SBG_RX
SBG_RS232_TX: U6.14(T1OUT) ; port SBG_TX
SBG_UART_RX: R38.2 U6.12(R1OUT)
SBG_UART_TX: R46.2 U6.11(T1IN)
UART1_RX: R47.1 ; port UART1_RX
UART1_TX: R46.1 ; port UART1_TX
NetC19_1: C19.1 U6.3(C1-)
NetC19_2: C19.2 U6.1(C1+)
NetC20_1: C20.1 U6.2(V+)
NetC21_1: C21.1 U6.6(V-)
NetC22_1: C22.1 U6.5(C2-)
NetC22_2: C22.2 U6.4(C2+)
NetQ7_1: Q7.1(G) Q8.1(G) R40.2 R41.2
NetR38_1: R38.1 R39.2 R47.2

Not connected (* = marked no-connect by the designer): U6 7(T2OUT) 9(R2OUT)

### Notes on the sheet
- UART to RS-232 converter
- With these pinouts, TX from U2 goes to RX on the SBG and vice versa

### Library data of the parts
C18 = CMP-2008-02046-2: as C1 on sheet SAME51_PINOUT; Package: C0402-BB; Temperature: -55°C to +125°C; ComponentLink2Description: Datasheet; Temperature Characteristic: X5R; Device Class L1: Passive Components; Height: 0.55mm; Lead Free: Yes; ComponentLink2URL: https://content.kemet.com/datasheets/KEM_C1002_X7R_SMD.pdf; Device Class L2: Capacitors; Temperature Range Low: -55°C; Temperature Range High: +125°C; RoHS: TRUE; Octopart: https://octopart.com/c0402c104k8pactu-kemet-140039; Automotive: No; Mouser Description: Capacitor 100 nF 10 VDC 0402; Category: Cap; Voltage Rating: 10 V; Digikey Description: CAP CER 0.1UF 10V X5R 0402; Ipc Land Pattern Name: CAPC10050X50; Device Class L3: Ceramic Capacitors; Manufacturer Part Number: C0402C104K8PACTU
C19 = CMP-2000-05997-2: CAP CER 4.7UF 10V X5R 0402; Dielectric Material: Ceramic; Tolerance: 10%; Series: C; Package Quantity: 10000; Max Operating Temperature: 85°C; Case Code (Imperial): 0402; Lead Free: Lead Free; Voltage Rating (DC): 10V; Packaging: Cut Tape; Voltage Rating: 10V; Min Operating Temperature: -55°C; Dielectric: X5R; Thickness: 0.022inch; Width: 0.02inch; Case/Package: 0402; Case Code (Metric): 1005; Capacitance: 4.7uF; Length: 0.039inch; RoHS Compliant: Yes; REACH SVHC: No SVHC; Mount: Surface Mount
C20-C22 = CMP-08246-005306-1: Multilayer Ceramic Capacitors 330nF ±10% 35V X5R SMD 0402; Dielectric: X5R; Case Code (Metric): 1005; Height: 0.5mm; Capacitance: 330nF; Max Operating Temperature: 85°C; Tolerance: 10%; Voltage Rating (DC): 35V; Voltage Rating: 35V; Lead Free: Lead Free; Mount: Surface Mount; Termination: SMD/SMT; Series: C; Dielectric Material: Ceramic; Thickness: 0.022inch; Length: 0.039inch; Package Quantity: 10000; Min Operating Temperature: -55°C; Case Code (Imperial): 0402; Packaging: Tape and Reel; RoHS Compliant: Yes; Width: 0.02inch; Weight: 2.3E-05oz; Case/Package: 0402
Q7 Q8 = CMP-2000-05968-1: N-Channel Enhancement Mode Mosfet, 50 V, 200 mA, -55 to 150 degC, 6-Pin SOT-323, RoHS, Tape and Reel; Typical Turn-Off Delay Time: 20ns; Number of Channels: 1Channel; Type: EnhancementModeFieldEffectTransistor; Brand: DiodesIncorporated; Vds - Drain-Source Breakdown Voltage: 75V; Vgs - Gate-Source Voltage: 20V; Rds On - Drain-Source Resistance: 1.4Ohms; Transistor Type: 1N-Channel; Configuration: Single; Unit Weight: 0.000212oz; Pd - Power Dissipation: 200mW; Id - Continuous Drain Current: 200mA; Forward Transconductance - Min: 0.1S; Manufacturer URL: http://www.diodes.com/; Series: BSS138; Package Description: 3-Pin Small Outline Transistor, Body 2 x 1.25 mm, Pitch 0.65 mm; Mounting Technology: SurfaceMount; Product Category: MOSFET; RoHS: True; Maximum Operating Temperature: +150C; Height: 1mm; Length: 2.2mm; Technology: Si; Width: 1.35mm; Datasheet URL: http://www.diodes.com/_files/datasheets/ds30206.pdf; Manufacturer: DiodesIncorporated; Package / Case: SOT-323-3; Typical Turn-On Delay Time: 20ns; Transistor Polarity: N-Channel; Factory Pack Quantity: 3000; Packaging: Reel; Product: MOSFETSmallSignal; Datasheet Version: Rev. 11-2, 09/2013; Package Reference: SOT323; Minimum Operating Temperature: -55C; Mounting Style: SMD/SMT; Channel Mode: Enhancement
R38 R40 = CMP-2000-00180-1: Manufacturer: Panasonic; Part Number: ERJ-3EKF1001V
R39 = CMP-2000-00294-1: Manufacturer: Panasonic; Part Number: ERJ3EKF1801V
R41 = CMP-1012-00623-3: as R1 on sheet SAME51_PINOUT; Number of Pins: 2; Package Reference: 603; Depth: 0.8mm; Mount: SurfaceMount; Package Description: 2-Pin Surface Mount Device, Body 1.6 x 0.85 mm; Datasheet Version: 02/2017; Length: 1.6mm; Lead Free: LeadFree; Height: 0.45mm; Number of Terminations: 2; Max Power Dissipation: 100mW; Min Operating Temperature: -55degC; Datasheet URL: https://industrial.panasonic.com/cdbs/www-data/pdf/RDA0000/AOA0000C304.pdf; Termination: SMD/SMT; Case Code (Metric): 1608; Case Code (Imperial): 0603; Tolerance: 1%; Max Operating Temperature: 155degC; RoHSCompliant: true; Voltage Rating (DC): 75V; Radiation Hardening: No; Packaging: TapeandReel; Composition: ThickFilm; Mounting Technology: SurfaceMount; Manufacturer URL: http://www.panasonic.com/; Width: 0.031inch; REACH SVHC: NoSVHC; Contact Plating: Tin; Military Standard: Not; Package Quantity: 1
R46 R47 = CMP-009-00206-2: READ THE NAME
U6 = CMP-05679-000039-1: IC TXRX RS-232 LP 16-TSSOP; Manufacturer: Maxim Integrated; Standoff Height: 0.05mm; Nominal Supply Current: 0.3mA; Simplex Duplex: Full Duplex; Max Supply Voltage: 5.5V; Data Rate: 120kbits/s; Min Supply Voltage: 3V; Number Of Receivers: 2; RoHS: TRUE; Mouser Description: MAX3232 Series 235 kbps 5.5V Surface Mount RS-232 Transceiver - TSSOP-16; Category: IC; Manufacturer Part Number: MAX3232EUE+T; Footprint Url: https://pdfserv.maximintegrated.com/land_patterns/90-0117.PDF; Device Class L2: Interface ICs; Automotive: No; ComponentLink2Description: Datasheet; Device Class L3: RS-232 / RS-422 / RS-485 Interface ICs; Temperature Range High: +85°C; Package: U16-1; Lead Free: Yes; Digikey Description: IC TXRX RS-232 LP 16-TSSOP; ComponentLink2URL: https://datasheets.maximintegrated.com/en/ds/MAX3222-MAX3241.pdf; Temperature: -40°C to +85°C; Number Of Transmitters: 2; Height: 1.1mm; Octopart: https://octopart.com/max3232eue%2Bt-maxim+integrated-39814427; Device Class L1: Integrated Circuits (ICs); Interface: RS-232; Temperature Range Low: -40°C

## Sheet SD.SchDoc
size A4; SheetNumber: 5; SheetTotal: 5
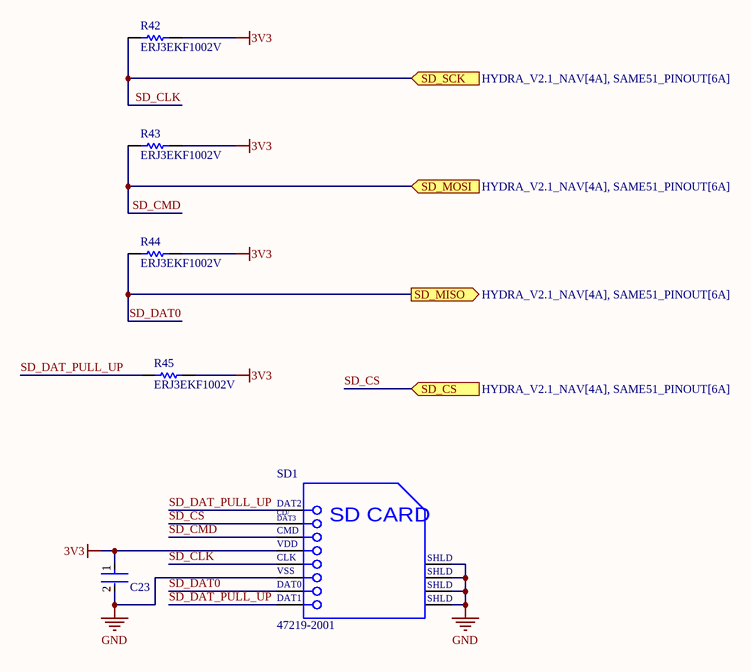
[diagram p3: SD.SchDoc]

### Parts
C23  C0402C104K8PACTU  [FP-C0402-BB-MFG]  (value not drawn)
R42  ERJ3EKF1002V  [RESC1609X55X30LL15T15]
R43  ERJ3EKF1002V  [RESC1609X55X30LL15T15]
R44  ERJ3EKF1002V  [RESC1609X55X30LL15T15]
R45  ERJ3EKF1002V  [RESC1609X55X30LL15T15]
SD1  47219-2001  [MOLX-47219-2001-8_V]

### Ports
SD_CS (in, see HYDRA_V2.1_NAV[4A], SAME51_PINOUT[6A]), SD_MISO (out, see HYDRA_V2.1_NAV[4A], SAME51_PINOUT[6A]), SD_MOSI (in, see HYDRA_V2.1_NAV[4A], SAME51_PINOUT[6A]), SD_SCK (in, see HYDRA_V2.1_NAV[4A], SAME51_PINOUT[6A])

### Nets
3V3: C23.1 R42.2 R43.2 R44.2 R45.2 SD1.4(VDD)
GND: C23.2 SD1.6(VSS) SD1.9(SHLD) SD1.10(SHLD) SD1.11(SHLD) SD1.12(SHLD)
SD_CLK: R42.1 SD1.5(CLK) ; port SD_SCK
SD_CMD: R43.1 SD1.3(CMD) ; port SD_MOSI
SD_CS: SD1.2(CD/DAT3) ; port SD_CS
SD_DAT0: R44.1 SD1.7(DAT0) ; port SD_MISO
SD_DAT_PULL_UP: R45.1 SD1.1(DAT2) SD1.8(DAT1)

### Notes on the sheet
- (in symbol CMP-2000-05245-1) CD/; DAT3; SD CARD

### Library data of the parts
C23 = CMP-2008-02046-2: as C1 on sheet SAME51_PINOUT; Package: C0402-BB; Temperature: -55°C to +125°C; ComponentLink2Description: Datasheet; Temperature Characteristic: X5R; Device Class L1: Passive Components; Height: 0.55mm; Lead Free: Yes; ComponentLink2URL: https://content.kemet.com/datasheets/KEM_C1002_X7R_SMD.pdf; Device Class L2: Capacitors; Temperature Range Low: -55°C; Temperature Range High: +125°C; RoHS: TRUE; Octopart: https://octopart.com/c0402c104k8pactu-kemet-140039; Automotive: No; Mouser Description: Capacitor 100 nF 10 VDC 0402; Category: Cap; Voltage Rating: 10 V; Digikey Description: CAP CER 0.1UF 10V X5R 0402; Ipc Land Pattern Name: CAPC10050X50; Device Class L3: Ceramic Capacitors; Manufacturer Part Number: C0402C104K8PACTU
R42-R45 = CMP-1012-00623-3: as R1 on sheet SAME51_PINOUT; Number of Pins: 2; Package Reference: 603; Depth: 0.8mm; Mount: SurfaceMount; Package Description: 2-Pin Surface Mount Device, Body 1.6 x 0.85 mm; Datasheet Version: 02/2017; Length: 1.6mm; Lead Free: LeadFree; Height: 0.45mm; Number of Terminations: 2; Max Power Dissipation: 100mW; Min Operating Temperature: -55degC; Datasheet URL: https://industrial.panasonic.com/cdbs/www-data/pdf/RDA0000/AOA0000C304.pdf; Termination: SMD/SMT; Case Code (Metric): 1608; Case Code (Imperial): 0603; Tolerance: 1%; Max Operating Temperature: 155degC; RoHSCompliant: true; Voltage Rating (DC): 75V; Radiation Hardening: No; Packaging: TapeandReel; Composition: ThickFilm; Mounting Technology: SurfaceMount; Manufacturer URL: http://www.panasonic.com/; Width: 0.031inch; REACH SVHC: NoSVHC; Contact Plating: Tin; Military Standard: Not; Package Quantity: 1
SD1 = CMP-2000-05245-1: MicroSD Card Connector, Hinge Type, -40 to 85 degC, 8-Pin SMD, RoHS, Tape and Reel; Manufacturer: Molex; Current Rating: 500mA; Number of Contacts: 8; Pitch: 1.09mm; Insertion - Extraction Style: Hinged; Voltage Rating: 100VDC; Product: CardConnectors; Contact Material: CopperAlloy; Series: 47219; Packaging: Reel; Brand: Molex; Product Category: MemoryCardConnectors; Housing Material: Thermoplastic; Mounting Style: SMD/SMT; Termination Style: SMD; Datasheet Version: Rev. F, 06/2009; Card Type: microSD; Manufacturer URL: http://www.molex.com/; RoHS: Details; Datasheet URL: http://www.molex.com/pdm_docs/sd/472192001_sd.pdf; Factory Pack Quantity: 2400

## Nets that join several sheets
3V3: SAME51_PINOUT (29 pins), SD (6 pins)
5V: HYDRA_V2.1_NAV (P2.4), SAME51_PINOUT (D1.2 R18.2 TP1.1), SBG (C18.1 U6.16)
GND: HYDRA_V2.1_NAV (38 pins), SAME51_PINOUT (42 pins), SBG (10 pins), SD (6 pins)
VCC: HYDRA_V2.1_NAV (J1.01 J1.02 J3.01 J3.02), SAME51_PINOUT (R20.2 TP2.1)
CAN0_R_N: HYDRA_V2.1_NAV (J1.16 J3.16), SAME51_PINOUT (R2.1 TP7.1 U2.6)
CAN0_R_P: HYDRA_V2.1_NAV (J1.15 J3.15), SAME51_PINOUT (R2.2 TP5.1 U2.7)
CAN1_R_N: HYDRA_V2.1_NAV (J1.20 J3.20), SAME51_PINOUT (R7.1 TP8.1 U5.6)
CAN1_R_P: HYDRA_V2.1_NAV (J1.19 J3.19), SAME51_PINOUT (R7.2 TP6.1 U5.7)
PYRO_PWR: HYDRA_V2.1_NAV (16 pins), SAME51_PINOUT (R21.2 TP12.1)
SBG_GND: HYDRA_V2.1_NAV (P2.1), SBG (Q7.3 Q8.3)
SBG_RS232_RX: HYDRA_V2.1_NAV (P2.3), SBG (U6.13)
SBG_RS232_TX: HYDRA_V2.1_NAV (P2.2), SBG (U6.14)
SD_CLK: SAME51_PINOUT (U1.14), SD (R42.1 SD1.5)
SD_CMD: SAME51_PINOUT (R30.1 U1.16), SD (R43.1 SD1.3)
SD_CS: SAME51_PINOUT (U1.15), SD (SD1.2)
SD_DAT0: SAME51_PINOUT (R27.1 U1.13), SD (R44.1 SD1.7)
UART1_RX: SAME51_PINOUT (R33.1 U1.17), SBG (R47.1)
UART1_TX: SAME51_PINOUT (R36.1 U1.18), SBG (R46.1)